# Altium schematic sheet power.SchDoc
size A4; SheetNumber: 1; SheetTotal: 2
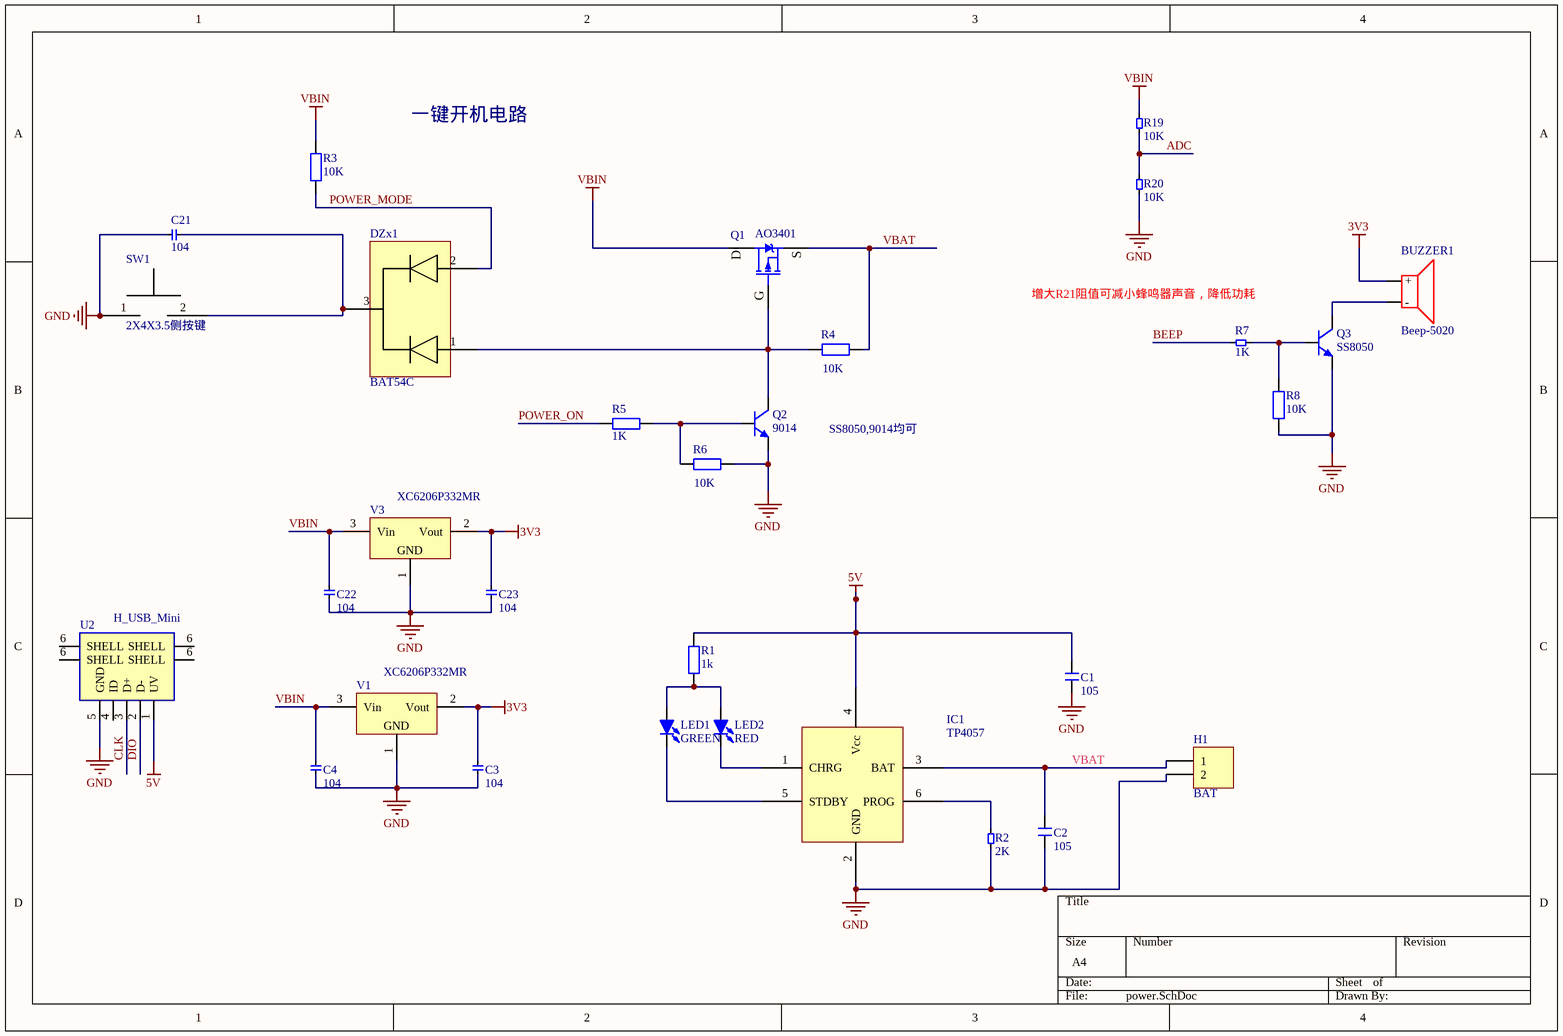
[diagram p0: power.SchDoc]

## Parts
BUZZER1  Beep-5020  [5020BUZZER]
C1  105  [C0603]
C2  105  [C0603]
C3  104  [C_0603]
C4  104  [C_0603]
C21  104  [C_0603]
C22  104  [C_0603]
C23  104  [C_0603]
DZx1  BAT54C  [SOT23-3N]
H1  BAT  [H_Header_1X2]
IC1  TP4057  [SOT23-6N]
LED1  GREEN  [D0603G]
LED2  RED  [D0603R]
Q1  AO3401  [SOT23-3N]
Q2  9014  [SOT23-3N]
Q3  SS8050  [SOT23-3N]
R1  1k  [R0603]
R2  2K  [R_0603]
R3  10K  [R0603]
R4  10K  [R0603]
R5  1K  [R0603]
R6  10K  [R0603]
R7  1K  [R_0603]
R8  10K  [R0603]
R19  10K  [R_0603]
R20  10K  [R_0603]
SW1  2X4X3.5侧按键  [2X4X3.5贴片侧按开关]
U2  H_USB_Mini  [H_USB_Mini_A]
V1  XC6206P332MR  [SOT23-3N]
V3  XC6206P332MR  [SOT23-3N]

## Nets
3V3: BUZZER1.1(+) C3.2 C23.2 V1.2(Vout) V3.2(Vout)
5V: C1.2 IC1.4(Vcc) R1.2 U2.1(UV)
GND: C1.1 C2.1 C3.1 C4.1 C21.1 C22.1 C23.1 H1.2 IC1.2(GND) Q2.2(E) Q3.2(E) R2.1 R6.2 R8.1 R20.2 SW1.1 U2.5(GND) V1.1(GND) V3.1(GND)
VBIN: C4.2 C22.2 Q1.3(D) R3.2 R19.1 V1.3(Vin) V3.3(Vin)
ADC: R19.2 R20.1
BEEP: R7.1
CLK: U2.3(D+)
DIO: U2.2(D-)
POWER_MODE: DZx1.2 R3.1
POWER_ON: R5.1
VBAT: C2.2 H1.1 IC1.3(BAT) Q1.2(S) R4.2
NetBUZZER1_2: BUZZER1.2(-) Q3.3(C)
NetC21_2: C21.2 DZx1.3 SW1.2
NetDZx1_1: DZx1.1 Q1.1(G) Q2.3(C) R4.1
NetIC1_1: IC1.1(CHRG) LED2.2(K)
NetIC1_5: IC1.5(STDBY) LED1.2(K)
NetIC1_6: IC1.6(PROG) R2.2
NetLED1_1: LED1.1(A) LED2.1(A) R1.1
NetQ2_1: Q2.1(B) R5.2 R6.1
NetQ3_1: Q3.1(B) R7.2 R8.2

Not connected (* = marked no-connect by the designer): U2 4(ID) 6(SHELL)

## Notes on the sheet
- 一键开机电路
- 增大R21阻值可减小蜂鸣器声音，降低功耗
- SS8050,9014均可

## Library data of the parts
BUZZER1 = Beep-5020: 贴片蜂鸣器5020最小封装
C1 C2 = C: 无极性贴片电容; 版权归属: 源创客; BOM名称: 无极性贴片电容; 学习资源: www.ooocke.com
C3 C4 C21-C23 = C_无极贴片: 无极性贴片电容
DZx1 = BAT54C: 双肖特基，共阴极
H1 = H_Header_1X2H: 单排2针排母; LatestRevisionDate: 17-Jul-2002; LatestRevisionNote: Re-released for DXP Platform.; Publisher: Altium Limited
IC1 = TP4057/4059: 500mA/600mA锂电池充电管理IC
LED1 LED2 = LED-SMD: 贴片LED; 版权归属: 源创客; BOM名称: 贴片LED; 学习资源: www.ooocke.com
Q1 = SI2301: P沟道场效应管; 版权归属: 源创客; BOM名称: P沟道场效应管; 学习资源: www.ooocke.com
Q2 = 9014-SMD: 低噪放大-NPN型; 版权归属: 源创客; 属性: 50V 0.1A 0.4W 150MHZ; BOM名称: 低噪放大-NPN型; 学习资源: www.ooocke.com
Q3 = 8050-SMD: 高频放大-NPN型; 版权归属: 源创客; 属性: 40V 1.5A 1W 100MHZ; BOM名称: 高频放大-NPN型; 学习资源: www.ooocke.com
R1 R3-R6 R8 = R: 贴片电阻; 版权归属: 源创客; BOM名称: 贴片电阻; 学习资源: www.ooocke.com
R2 R7 R19 R20 = R_贴片: 贴片电阻
U2 = H_USB_Mini: MiniUSB头母头
V1 V3 = XC6206P332MR: 低压差线性稳压芯片; 版权归属: 源创客; BOM名称: 低压差线性稳压芯片; 学习资源: www.ooocke.com